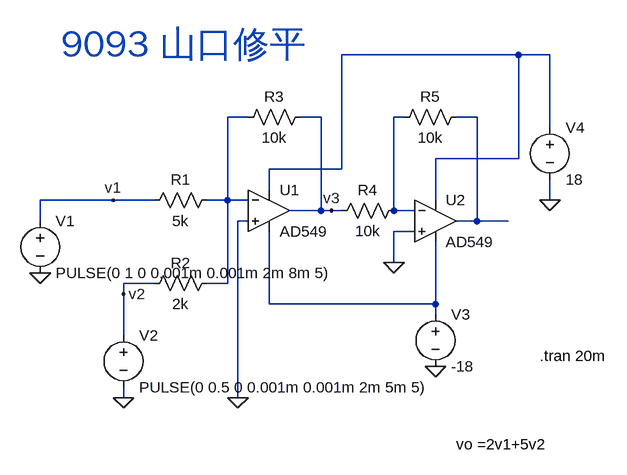
[diagram p0: schematic Draft7.asc]
Draft7.asc, the LTspice schematic file:
Version 4
SHEET 1 912 720
WIRE 768 80 496 80
WIRE 816 80 768 80
WIRE 352 176 320 176
WIRE 464 176 432 176
WIRE 592 176 576 176
WIRE 704 176 672 176
WIRE 816 192 816 80
WIRE 768 240 768 80
WIRE 768 240 640 240
WIRE 496 256 496 80
WIRE 496 256 384 256
WIRE 384 288 384 256
WIRE 144 304 32 304
WIRE 208 304 144 304
WIRE 320 304 320 176
WIRE 320 304 288 304
WIRE 352 304 320 304
WIRE 640 304 640 240
WIRE 816 304 816 272
WIRE 464 320 464 176
WIRE 464 320 416 320
WIRE 480 320 464 320
WIRE 496 320 480 320
WIRE 576 320 576 176
WIRE 608 320 576 320
WIRE 32 336 32 304
WIRE 352 336 336 336
WIRE 704 336 704 176
WIRE 704 336 672 336
WIRE 752 336 704 336
WIRE 608 352 576 352
WIRE 576 400 576 352
WIRE 208 432 160 432
WIRE 320 432 320 304
WIRE 320 432 288 432
WIRE 160 448 160 432
WIRE 384 464 384 352
WIRE 640 464 640 368
WIRE 640 464 384 464
WIRE 640 480 640 464
WIRE 160 512 160 448
WIRE 160 608 160 592
WIRE 336 608 336 336
FLAG 816 304 0
FLAG 640 560 0
FLAG 160 608 0
FLAG 32 416 0
FLAG 336 608 0
FLAG 160 448 v2
FLAG 480 320 v3
FLAG 144 304 v1
FLAG 576 400 0
SYMBOL res 304 288 R90
WINDOW 0 0 56 VBottom 2
WINDOW 3 32 56 VTop 2
SYMATTR InstName R1
SYMATTR Value 5k
SYMBOL res 304 416 R90
WINDOW 0 0 56 VBottom 2
WINDOW 3 32 56 VTop 2
SYMATTR InstName R2
SYMATTR Value 2k
SYMBOL res 448 160 R90
WINDOW 0 0 56 VBottom 2
WINDOW 3 32 56 VTop 2
SYMATTR InstName R3
SYMATTR Value 10k
SYMBOL AD549 384 256 R0
SYMATTR InstName U1
SYMBOL AD549 640 272 R0
SYMATTR InstName U2
SYMBOL voltage 32 320 R0
WINDOW 123 0 0 Left 0
WINDOW 39 0 0 Left 0
SYMATTR InstName V1
SYMATTR Value PULSE(0 1 0 0.001m 0.001m 2m 8m 5)
SYMBOL voltage 160 496 R0
WINDOW 123 0 0 Left 0
WINDOW 39 0 0 Left 0
SYMATTR InstName V2
SYMATTR Value PULSE(0 0.5 0 0.001m 0.001m 2m 5m 5)
SYMBOL voltage 640 464 R0
SYMATTR InstName V3
SYMATTR Value -18
SYMBOL res 592 304 R90
WINDOW 0 0 56 VBottom 2
WINDOW 3 32 56 VTop 2
SYMATTR InstName R4
SYMATTR Value 10k
SYMBOL res 688 160 R90
WINDOW 0 0 56 VBottom 2
WINDOW 3 32 56 VTop 2
SYMATTR InstName R5
SYMATTR Value 10k
SYMBOL voltage 816 176 R0
SYMATTR InstName V4
SYMATTR Value 18
TEXT 800 544 Left 2 !.tran 20m
TEXT 64 64 Left 5 ;9093 山口修平
TEXT 672 680 Left 2 !vo =2v1+5v2

The netlist it stands for:
* Draft7.asc
R1 N002 v1 5k
R2 N002 v2 2k
R3 v3 N002 10k
XU1 0 N002 N001 N005 v3 AD549  ; pins In+ In- V+ V- OUT
XU2 0 N003 N001 N005 N004 AD549  ; pins In+ In- V+ V- OUT
V1 v1 0 PULSE(0 1 0 0.001m 0.001m 2m 8m 5)
V2 v2 0 PULSE(0 0.5 0 0.001m 0.001m 2m 5m 5)
V3 N005 0 -18
R4 N003 v3 10k
R5 N004 N003 10k
V4 N001 0 18
.tran 20m
* 9093 山口修平
vo =2v1+5v2
.backanno
.end